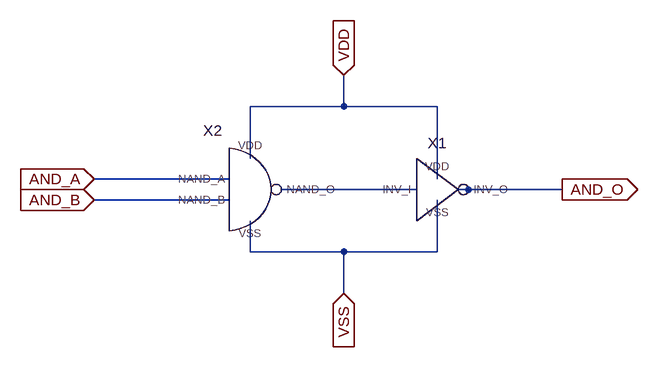
[diagram p0: schematic m_And.asc]
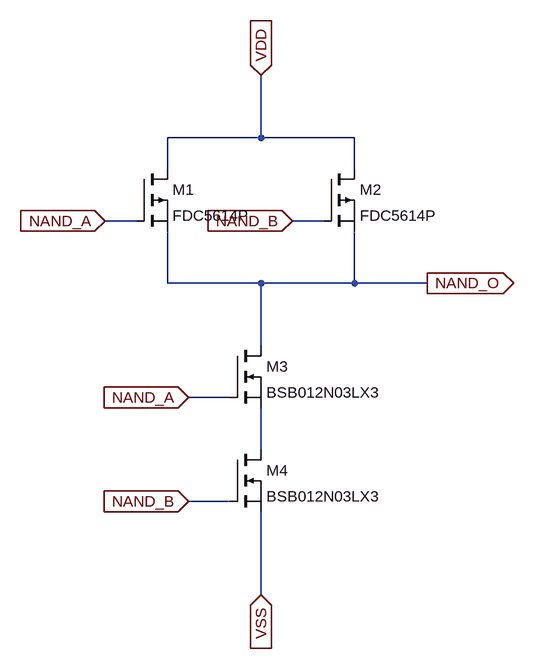
[diagram p1: sub-circuit m_nand.asc]
m_And.asc, the LTspice schematic file:
Version 4
SHEET 1 1056 680
WIRE 576 -16 576 -64
WIRE 576 -16 432 -16
WIRE 720 -16 576 -16
WIRE 432 64 432 -16
WIRE 400 96 192 96
WIRE 720 96 720 -16
WIRE 688 112 480 112
WIRE 912 112 752 112
WIRE 400 128 192 128
WIRE 432 208 432 160
WIRE 576 208 432 208
WIRE 720 208 720 128
WIRE 720 208 576 208
WIRE 576 272 576 208
FLAG 192 96 AND_A
IOPIN 192 96 In
FLAG 192 128 AND_B
IOPIN 192 128 In
FLAG 912 112 AND_O
IOPIN 912 112 Out
FLAG 576 -64 VDD
IOPIN 576 -64 In
FLAG 576 272 VSS
IOPIN 576 272 In
SYMBOL m_Inverter 720 112 R0
SYMATTR InstName X1
SYMBOL m_Nand 464 112 R0
SYMATTR InstName X2

m_nand.asc, the sub-circuit schematic file:
Version 4
SHEET 1 880 680
WIRE 192 -336 192 -432
WIRE 192 -336 48 -336
WIRE 336 -336 192 -336
WIRE 48 -288 48 -336
WIRE 336 -288 336 -336
WIRE 0 -208 -48 -208
WIRE 288 -208 240 -208
WIRE 48 -112 48 -192
WIRE 192 -112 48 -112
WIRE 336 -112 336 -192
WIRE 336 -112 192 -112
WIRE 448 -112 336 -112
WIRE 192 -16 192 -112
WIRE 144 64 80 64
WIRE 192 144 192 80
WIRE 144 224 80 224
WIRE 192 368 192 240
FLAG 192 -432 VDD
IOPIN 192 -432 In
FLAG 192 368 VSS
IOPIN 192 368 In
FLAG -48 -208 NAND_A
IOPIN -48 -208 In
FLAG 448 -112 NAND_O
IOPIN 448 -112 Out
FLAG 240 -208 NAND_B
IOPIN 240 -208 In
FLAG 80 64 NAND_A
IOPIN 80 64 In
FLAG 80 224 NAND_B
IOPIN 80 224 In
SYMBOL pmos 0 -288 R0
SYMATTR InstName M1
SYMATTR Value FDC5614P
SYMBOL pmos 288 -288 R0
SYMATTR InstName M2
SYMATTR Value FDC5614P
SYMBOL nmos 144 -16 R0
SYMATTR InstName M3
SYMATTR Value BSB012N03LX3
SYMBOL nmos 144 144 R0
SYMATTR InstName M4
SYMATTR Value BSB012N03LX3

The netlist it stands for:
* m_And.asc
XX1 N001 VDD VSS AND_O m_Inverter  ; pins INV_I VDD VSS INV_O
XX2 AND_A AND_B VDD VSS N001 m_nand

* block symbol definitions
.subckt m_nand NAND_A NAND_B VDD VSS NAND_O
M1 VDD NAND_A NAND_O NAND_O FDC5614P
M2 VDD NAND_B NAND_O NAND_O FDC5614P
M3 NAND_O NAND_A N001 N001 BSB012N03LX3
M4 N001 NAND_B VSS VSS BSB012N03LX3
.ends m_nand

.model NMOS NMOS
.model PMOS PMOS
.lib standard.mos
.backanno
.end